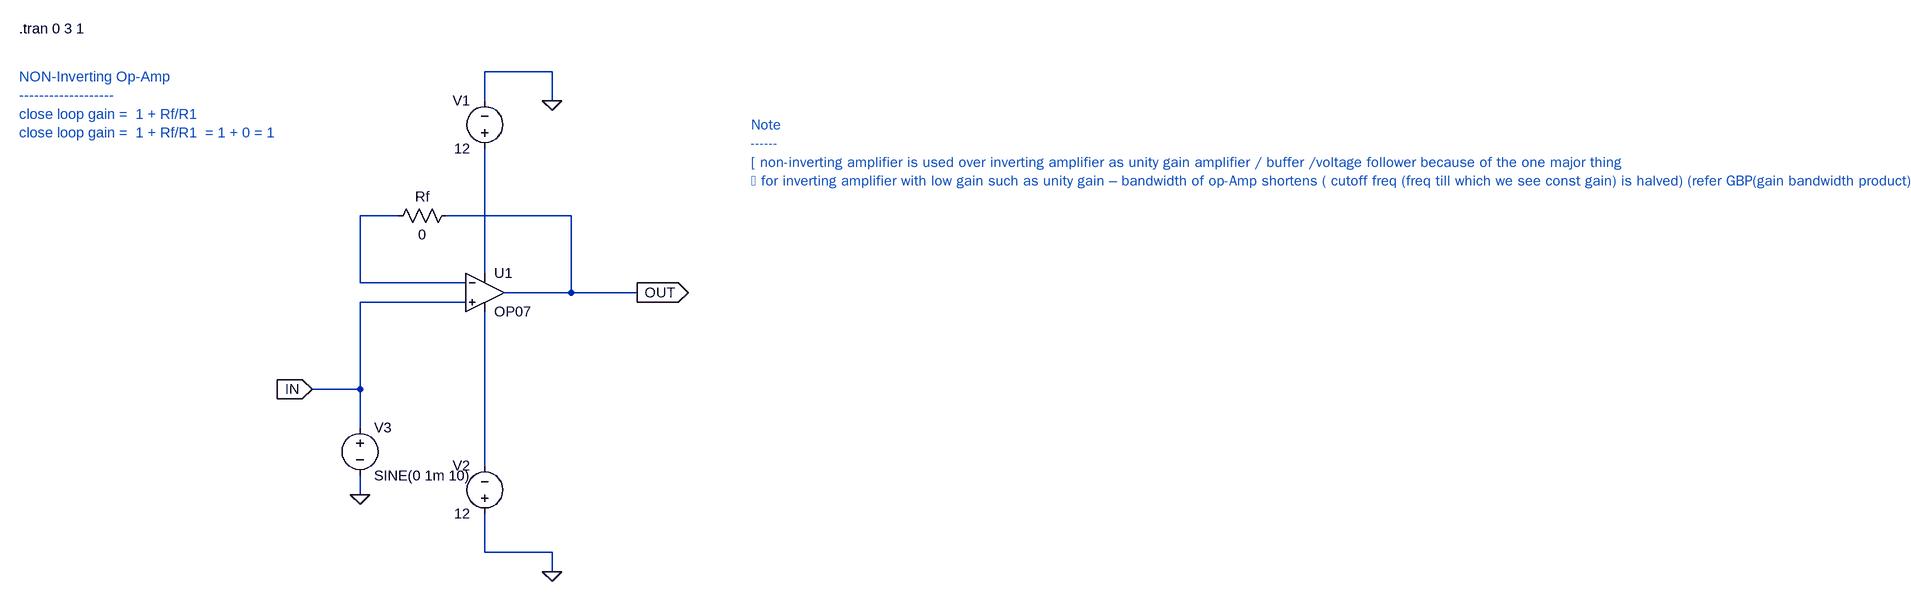
[diagram p0: schematic close_loop_non_inverting_amplifier_as_voltage_follower_or_buffer_with_AC_input.asc]
close_loop_non_inverting_amplifier_as_voltage_follower_or_buffer_with_AC_input.asc, the LTspice schematic file:
Version 4.1
SHEET 1 2968 724
WIRE 192 -288 80 -288
WIRE 80 -240 80 -288
WIRE 192 -240 192 -288
WIRE -64 -48 -128 -48
WIRE 224 -48 16 -48
WIRE 80 48 80 -160
WIRE -128 64 -128 -48
WIRE 48 64 -128 64
WIRE 224 80 224 -48
WIRE 224 80 112 80
WIRE 352 80 224 80
WIRE 48 96 -128 96
WIRE -128 256 -128 96
WIRE -128 256 -208 256
WIRE -128 320 -128 256
WIRE 80 384 80 112
WIRE -128 432 -128 400
WIRE 80 528 80 464
WIRE 192 528 80 528
WIRE 192 560 192 528
FLAG 192 -240 0
FLAG 192 560 0
FLAG -128 432 0
FLAG 352 80 OUT
IOPIN 352 80 Out
FLAG -208 256 IN
IOPIN -208 256 In
SYMBOL voltage 80 -144 R180
WINDOW 0 24 96 Left 2
WINDOW 3 24 16 Left 2
WINDOW 123 0 0 Left 0
WINDOW 39 0 0 Left 0
SYMATTR InstName V1
SYMATTR Value 12
SYMBOL voltage 80 480 R180
WINDOW 0 24 96 Left 2
WINDOW 3 24 16 Left 2
WINDOW 123 0 0 Left 0
WINDOW 39 0 0 Left 0
SYMATTR InstName V2
SYMATTR Value 12
SYMBOL OpAmps\\OP07 80 16 R0
SYMATTR InstName U1
SYMBOL res 32 -64 R90
WINDOW 0 0 56 VBottom 2
WINDOW 3 32 56 VTop 2
SYMATTR InstName Rf
SYMATTR Value 0
SYMBOL voltage -128 304 R0
WINDOW 123 0 0 Left 0
WINDOW 39 0 0 Left 0
SYMATTR InstName V3
SYMATTR Value SINE(0 1m 10)
TEXT -696 -360 Left 2 !.tran 0 3 1
TEXT -696 -280 Left 2 ;NON-Inverting Op-Amp\n-------------------\nclose loop gain =  1 + Rf/R1\nclose loop gain =  1 + Rf/R1  = 1 + 0 = 1
TEXT 816 -200 Left 2 ;Note \n------\n[ non-inverting amplifier is used over inverting amplifier as unity gain amplifier / buffer /voltage follower because of the one major thing\n for inverting amplifier with low gain such as unity gain – bandwidth of op-Amp shortens ( cutoff freq (freq till which we see const gain) is halved) (refer GBP(gain bandwidth product))

The netlist it stands for:
* close_loop_non_inverting_amplifier_as_voltage_follower_or_buffer_with_AC_input.asc
V1 N002 0 12
V2 0 N003 12
X§U1 IN N001 N002 N003 OUT LT1001  ; OP07, pins In+ In- V+ V- OUT
Rf OUT N001 0
V3 IN 0 SINE(0 1m 10)
.tran 0 3 1
* NON-Inverting Op-Amp
* -------------------
* close loop gain =  1 + Rf/R1
* close loop gain =  1 + Rf/R1  = 1 + 0 = 1
* Note
* ------
* [ non-inverting amplifier is used over inverting amplifier as unity gain amplifier / buffer /voltage follower because of the one major thing
*  for inverting amplifier with low gain such as unity gain – bandwidth of op-Amp shortens ( cutoff freq (freq till which we see const gain) is halved) (refer GBP(gain bandwidth product))
.lib LTC.lib
.backanno
.end